# Altium schematic sheet Top.SchDoc
size A3; SheetNumber: 1
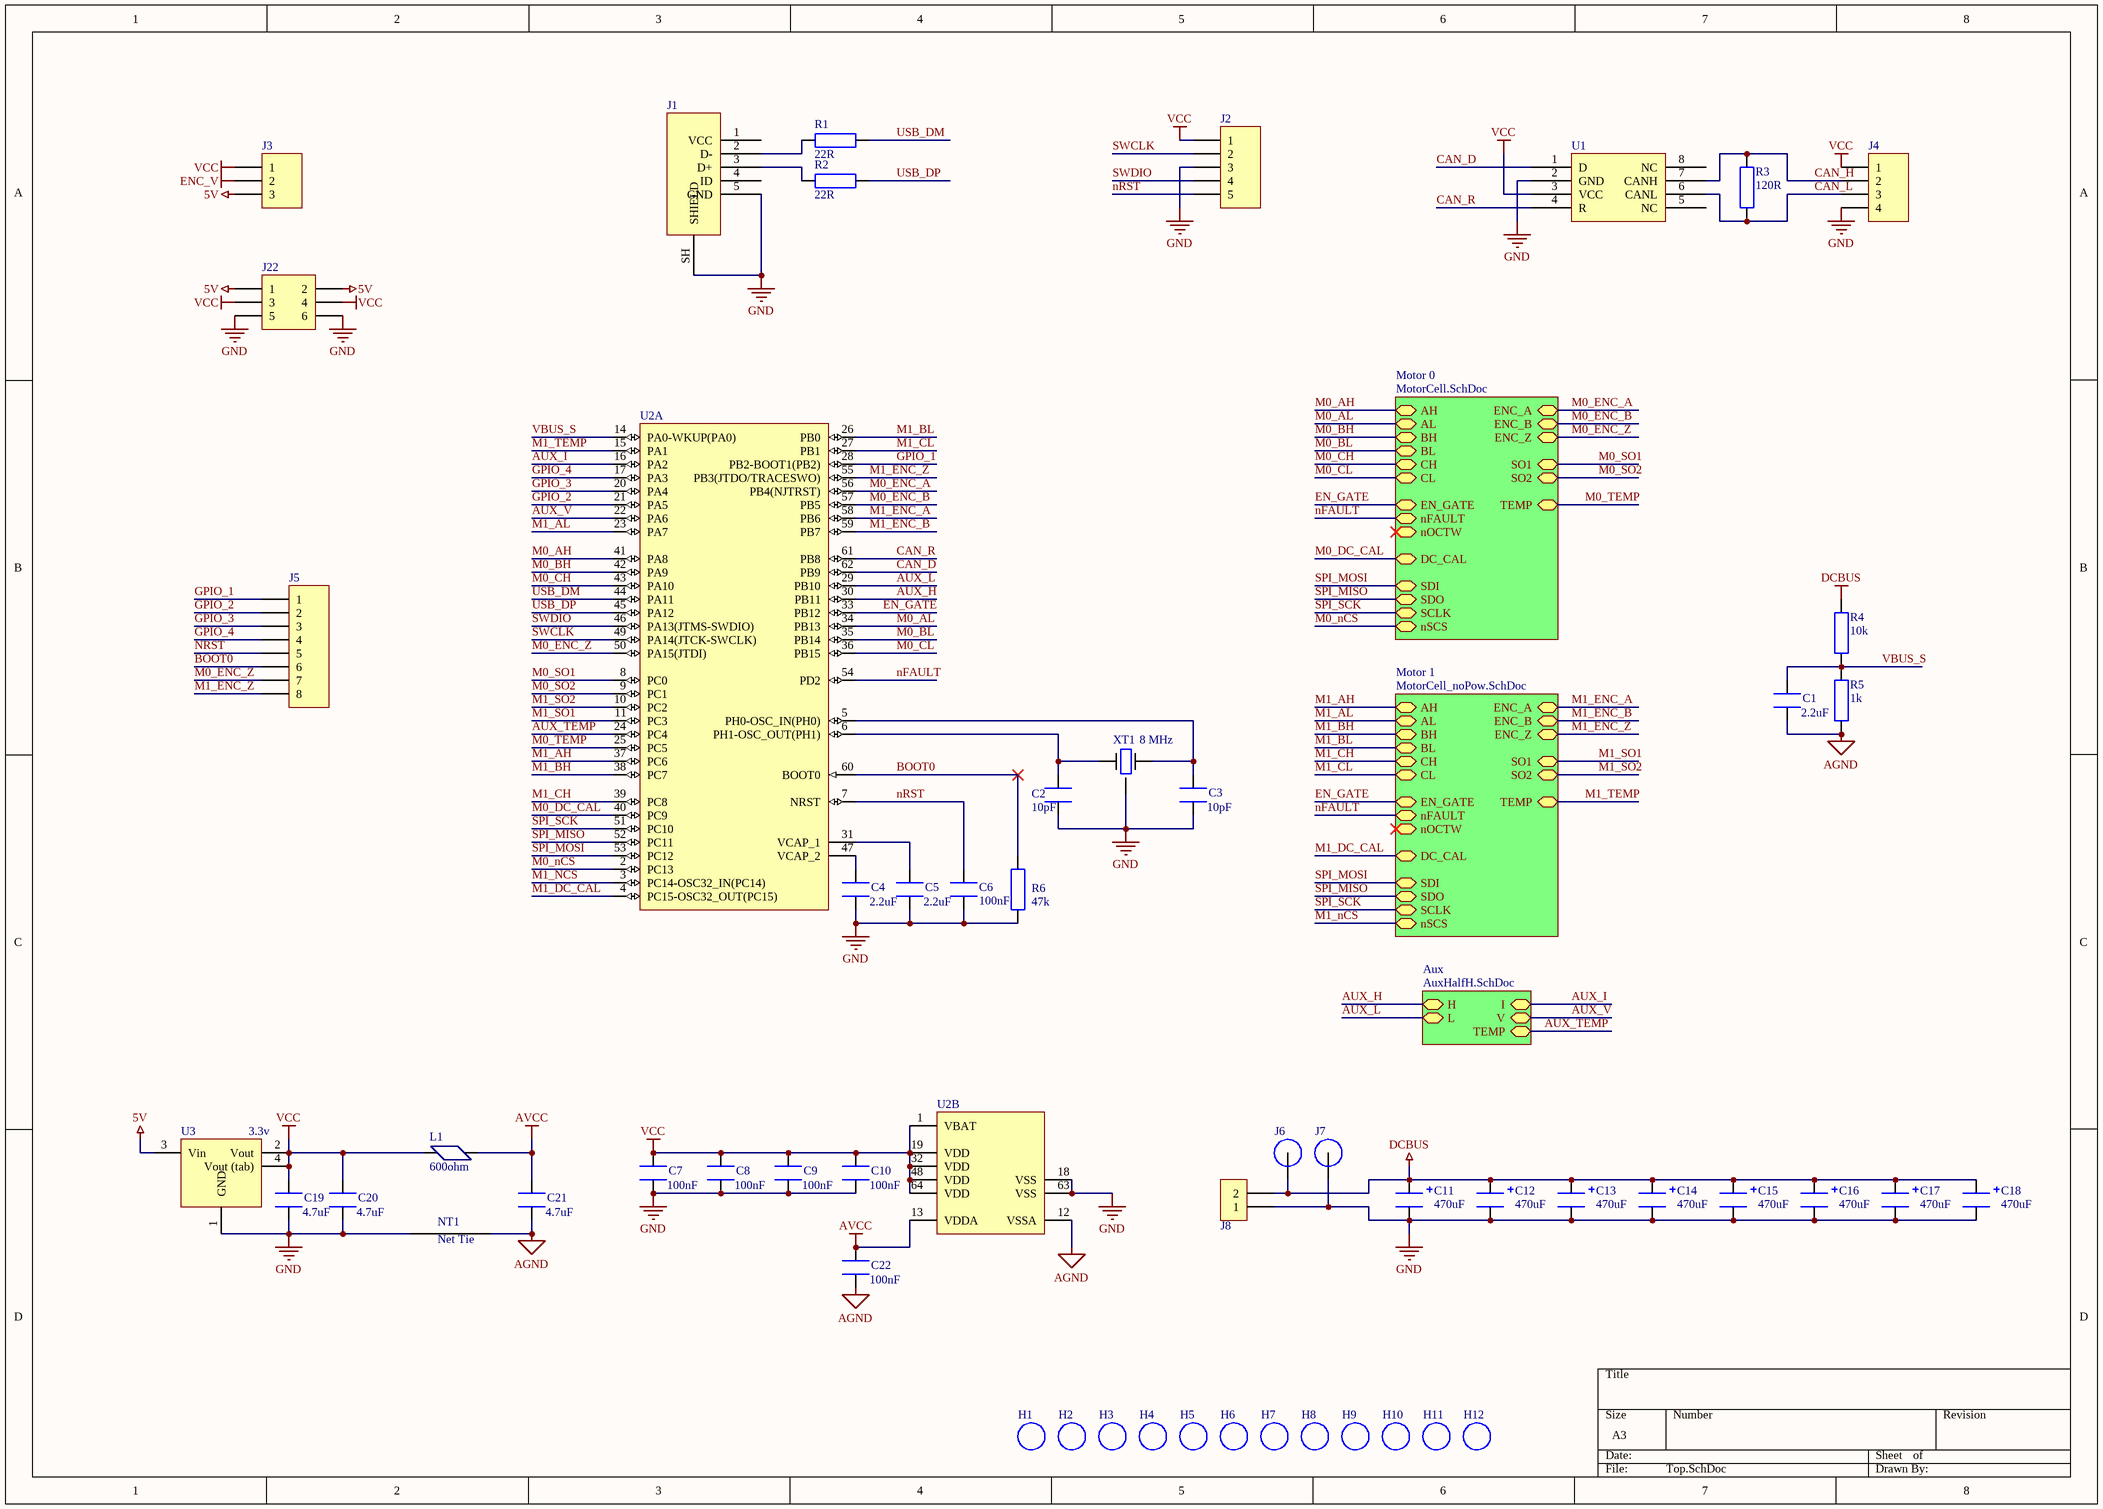
[diagram p0: Top.SchDoc]

## Parts
C1  value 2.2uF  [1608[0603]]
C2  value 10pF  [1608[0603]]
C3  value 10pF  [1608[0603]]
C4  value 2.2uF  [1608[0603]]
C5  value 2.2uF  [1608[0603]]
C6  value 100nF  [1608[0603]]
C7  value 100nF  [1608[0603]]
C8  value 100nF  [1608[0603]]
C9  value 100nF  [1608[0603]]
C10  value 100nF  [1608[0603]]
C11  value 470uF  [CAP_ELEC_SIZE_G]
C12  value 470uF  [CAP_ELEC_SIZE_G]
C13  value 470uF  [CAP_ELEC_SIZE_G]
C14  value 470uF  [CAP_ELEC_SIZE_G]
C15  value 470uF  [CAP_ELEC_SIZE_G]
C16  value 470uF  [CAP_ELEC_SIZE_G]
C17  value 470uF  [CAP_ELEC_SIZE_G]
C18  value 470uF  [CAP_ELEC_SIZE_G]
C19  value 4.7uF  [CAPC2012X09N]
C20  value 4.7uF  [CAPC2012X09N]
C21  value 4.7uF  [CAPC2012X09N]
C22  value 100nF  [1608[0603]]
H1  (no value)  [M3 Hole]
H2  (no value)  [M3 Hole]
H3  (no value)  [M3 Hole]
H4  (no value)  [M3 Hole]
H5  (no value)  [M3 Hole]
H6  (no value)  [M3 Hole]
H7  (no value)  [M3 Hole]
H8  (no value)  [M3 Hole]
H9  (no value)  [M3 Hole]
H10  (no value)  [M3 Hole]
H11  (no value)  [M3 Hole]
H12  (no value)  [M3 Hole]
J1  (no value)  [USB_0103594-0001LF]
J2  (no value)  [HDR1X5]
J3  (no value)  [HDR1X3]
J4  (no value)  [HDR1X4]
J5  (no value)  [HDR1X8]
J6  (no value)  [M3 Spade Hole]
J7  (no value)  [M3 Spade Hole]
J8  (no value)  [MC000054]
J22  (no value)  [HDR2X3]
L1  value 600ohm  [FBC2012N]
NT1  (no value)  [NetTie_2mm]  (net tie, no BOM)
R1  value 22R  [RESC1608X55N]
R2  value 22R  [RESC1608X55N]
R3  value 120R  [RESC1608X55N]
R4  value 10k  [RESC1608X55N]
R5  value 1k  [RESC1608X55N]
R6  value 47k  [RESC1608X55N]
U1  (no value)  [SOIC127P600X175-8N]
U2  (no value)  [STM-LQFP64_N]  (parts A,B of 2)
U3  value 3.3v  [SOT223]
XT1  value 8 MHz  [DFN220P320X110-4N]

## Sub-sheets
Aux = AuxHalfH.SchDoc: H, L, I, TEMP, V
Motor 0 = MotorCell.SchDoc: nFAULT, nOCTW, EN_GATE, DC_CAL, SDI, SDO, SCLK, nSCS, SO1, SO2, ENC_A, ENC_B, ENC_Z, AH, AL, BH, BL, CH, CL, TEMP
Motor 1 = MotorCell_noPow.SchDoc: nFAULT, nOCTW, EN_GATE, DC_CAL, SDI, SDO, SCLK, nSCS, SO1, SO2, ENC_A, ENC_B, ENC_Z, AH, AL, BH, BL, CH, CL, TEMP

## Nets
5V: J3.3 J22.1 J22.2 U3.3(Vin)
AGND: C1.1 C21.1 C22.2 NT1.2 R5.2 U2.12(VSSA)
AVCC: C21.2 C22.1 L1.1 U2.13(VDDA)
DCBUS: C11.1 C12.1 C13.1 C14.1 C15.1 C16.1 C17.1 C18.1 J6.1 J8.2 R4.1
ENC_V: J3.2
GND: C2.2 C3.2 C4.1 C5.1 C6.1 C7.2 C8.2 C9.2 C10.2 C11.2 C12.2 C13.2 C14.2 C15.2 C16.2 C17.2 C18.2 C19.1 C20.1 J1.5(GND) J1.SH(SHIELD) J2.3 J4.4 J7.1 J8.1 J22.5 J22.6 NT1.1 R6.2 U1.2(GND) U2.18(VSS) U2.63(VSS) U3.1(GND) XT1.G
VCC: C7.1 C8.1 C9.1 C10.1 C19.2 C20.2 J2.1 J3.1 J4.1 J22.3 J22.4 L1.2 U1.3(VCC) U2.1(VBAT) U2.19(VDD) U2.32(VDD) U2.48(VDD) U2.64(VDD) U3.2(Vout) U3.4(Vout_(tab))
AUX_H: U2.30(PB11) ; sheet Aux/H
AUX_I: U2.16(PA2) ; sheet Aux/I
AUX_L: U2.29(PB10) ; sheet Aux/L
AUX_TEMP: U2.24(PC4) ; sheet Aux/TEMP
AUX_V: U2.22(PA6) ; sheet Aux/V
BOOT0: J5.6 R6.1 U2.60(BOOT0)
CAN_D: U1.1(D) U2.62(PB9)
CAN_H: J4.2 R3.2 U1.7(CANH)
CAN_L: J4.3 R3.1 U1.6(CANL)
CAN_R: U1.4(R) U2.61(PB8)
EN_GATE: U2.33(PB12) ; sheet Motor 0/EN_GATE, sheet Motor 1/EN_GATE
GPIO_1: J5.1 U2.28(PB2-BOOT1(PB2))
GPIO_2: J5.2 U2.21(PA5)
GPIO_3: J5.3 U2.20(PA4)
GPIO_4: J5.4 U2.17(PA3)
M0_AH: U2.41(PA8) ; sheet Motor 0/AH
M0_AL: U2.34(PB13) ; sheet Motor 0/AL
M0_BH: U2.42(PA9) ; sheet Motor 0/BH
M0_BL: U2.35(PB14) ; sheet Motor 0/BL
M0_CH: U2.43(PA10) ; sheet Motor 0/CH
M0_CL: U2.36(PB15) ; sheet Motor 0/CL
M0_DC_CAL: U2.40(PC9) ; sheet Motor 0/DC_CAL
M0_ENC_A: U2.56(PB4(NJTRST)) ; sheet Motor 0/ENC_A
M0_ENC_B: U2.57(PB5) ; sheet Motor 0/ENC_B
M0_ENC_Z: J5.7 U2.50(PA15(JTDI)) ; sheet Motor 0/ENC_Z
M0_nCS: U2.2(PC13) ; sheet Motor 0/nSCS
M0_SO1: U2.8(PC0) ; sheet Motor 0/SO1
M0_SO2: U2.9(PC1) ; sheet Motor 0/SO2
M0_TEMP: U2.25(PC5) ; sheet Motor 0/TEMP
M1_AH: U2.37(PC6) ; sheet Motor 1/AH
M1_AL: U2.23(PA7) ; sheet Motor 1/AL
M1_BH: U2.38(PC7) ; sheet Motor 1/BH
M1_BL: U2.26(PB0) ; sheet Motor 1/BL
M1_CH: U2.39(PC8) ; sheet Motor 1/CH
M1_CL: U2.27(PB1) ; sheet Motor 1/CL
M1_DC_CAL: U2.4(PC15-OSC32_OUT(PC15)) ; sheet Motor 1/DC_CAL
M1_ENC_A: U2.58(PB6) ; sheet Motor 1/ENC_A
M1_ENC_B: U2.59(PB7) ; sheet Motor 1/ENC_B
M1_ENC_Z: J5.8 U2.55(PB3(JTDO/TRACESWO)) ; sheet Motor 1/ENC_Z
M1_nCS: U2.3(PC14-OSC32_IN(PC14)) ; sheet Motor 1/nSCS
M1_SO1: U2.11(PC3) ; sheet Motor 1/SO1
M1_SO2: U2.10(PC2) ; sheet Motor 1/SO2
M1_TEMP: U2.15(PA1) ; sheet Motor 1/TEMP
nFAULT: U2.54(PD2) ; sheet Motor 0/nFAULT, sheet Motor 1/nFAULT
nRST: C6.2 J2.5 J5.5 U2.7(NRST)
SPI_MISO: U2.52(PC11) ; sheet Motor 0/SDO, sheet Motor 1/SDO
SPI_MOSI: U2.53(PC12) ; sheet Motor 0/SDI, sheet Motor 1/SDI
SPI_SCK: U2.51(PC10) ; sheet Motor 0/SCLK, sheet Motor 1/SCLK
SWCLK: J2.2 U2.49(PA14(JTCK-SWCLK))
SWDIO: J2.4 U2.46(PA13(JTMS-SWDIO))
USB_DM: R1.2 U2.44(PA11)
USB_DP: R2.2 U2.45(PA12)
VBUS_S: C1.2 R4.2 R5.1 U2.14(PA0-WKUP(PA0))
NetC2_1: C2.1 U2.6(PH1-OSC_OUT(PH1)) XT1.1
NetC3_1: C3.1 U2.5(PH0-OSC_IN(PH0)) XT1.3
NetC4_2: C4.2 U2.47(VCAP_2)
NetC5_2: C5.2 U2.31(VCAP_1)
NetJ1_2: J1.2(D-) R1.1
NetJ1_3: J1.3(D+) R2.1

Not connected (* = marked no-connect by the designer): J1 1(VCC) 4(ID); U1 5(NC) 8(NC)

## Notes on the sheet
- (in symbol NetTie_2mm) Net Tie

## Library data of the parts
C1-C10 C22 = CAP_0603: CAP General 0603
C11-C18 = EEEFP1E471AP: CAP, FP Series, 470 µF, 25 V, Radial Can - SMD, 10 mm
C19-C21 = GRM219R6YA475KA73D: CAP CER 4.7UF 35V X5R 0805
H1-H12 = M3 Hole: M3 Hole with no copper
J1 = 10103594-0001LF: MICRO USB B, RECEPTACLE, SMT, RA, 5WAY; Supplier 1: Farnell; Supplier Part Number 1: 2293752
J2 = Header 5: Header, 5-Pin; LatestRevisionDate: 17-Jul-2002; LatestRevisionNote: Re-released for DXP Platform.; Publisher: Altium Limited
J3 = Header 3: Header, 3-Pin; LatestRevisionDate: 17-Jul-2002; LatestRevisionNote: Re-released for DXP Platform.; Publisher: Altium Limited
J4 = Header 4: Header, 4-Pin; LatestRevisionDate: 17-Jul-2002; LatestRevisionNote: Re-released for DXP Platform.; Publisher: Altium Limited
J5 = Header 8: Header, 8-Pin; LatestRevisionDate: 17-Jul-2002; LatestRevisionNote: Re-released for DXP Platform.; Publisher: Altium Limited
J6 J7 = M3 Spade Terminal
J8 = MC000054: MULTICOMP Wire-To-Board Terminal Block, 2, 600 V, 30 A, 24 AWG, 10 AWG
J22 = Header 3X2: Header, 3-Pin, Dual row; LatestRevisionDate: 17-Jul-2002; LatestRevisionNote: Re-released for DXP Platform.; Publisher: Altium Limited
L1 = 2508056017Y2: FERRITE BEAD, 0.1OHM, 2A, 0805; Supplier 1: Farnell; Supplier 2: Farnell; Supplier Part Number 1: 1838838; Supplier Part Number 2: 1838838RL
NT1 = NetTie_2mm
R1-R6 = RES_0603: RES General 1% 0603
U1 = SN65HVD232D: 3.3-V CAN Bus Transceiver
U2 = STM32F405RGT6: ARM Cortex-M4 32-bit MCU+FPU, 210 DMIPS, 1024 kB Flash, 192 kB Internal RAM, 51 I/Os, 64-pin LQFP, -40 to 85 degC, Tray; Manufacturer: STMicroelectronics; D/A Converter: 2x12-bit; FLASH Size (Prog) (kB): 1024; I/Os (High Current): 51; Internal RAM Size (kB): 192; Operating Frequency(F) (Processor speed) (MHz): 168; Supply Voltage(Vcc) max (V): 3.6; Supply Voltage(Vcc) min (V): 1.8; DatasheetVersion: Rev. 4; PackageVersion: Rev. 4, 06/2013; PackageReference: LQFP64; PackageDescription: 64-Pin Low Profile Quad Flat Package, 10 x 10 mm Body, 0.5 mm Pitch; Supplier 1: Digi-Key; Supplier Part Number 1: 497-11767-ND; Supplier 2: Farnell; Supplier Part Number 2: 2064363; Supplier 3: Newark; Supplier Part Number 3: 73T2329; Supplier 4: Mouser; Supplier Part Number 4: 511-STM32F405RGT6; Core: ARM Cortex-M4; Packing: Tray; Mounting Technology: Surface Mount; PartNumber: STM32F405RGT6; ComponentLink1Description: Manufacturer URL; ComponentLink1URL: http://www.st.com/web/en/home.html; ComponentLink2Description: Datasheet; ComponentLink2URL: http://www.st.com/st-web-ui/static/active/en/resource/technical/document/datasheet/DM00037051.pdf; ComponentLink3Description: Package Specification; ComponentLink3URL: http://www.st.com/st-web-ui/static/active/en/resource/technical/document/datasheet/DM00037051.pdf
U3 = AP1117E33G-13: IC, LDO, REG, 3.3V, SOT223; Supplier 1: Farnell; Supplier 2: Farnell; Supplier Part Number 1: 1825291RL; Supplier Part Number 2: 1825291
XT1 = ABM3B-8.000MHZ-10-1-U-T: Crystal 8MHz ±10ppm 10pF 200 Ohm -10°C ~ 60°C Surface Mount 4-SMD, No Lead (DFN, LCC)